# Altium schematic sheet ETH_Wifi.SCHDOC
size A4; SheetNumber: 0; SheetTotal: 0
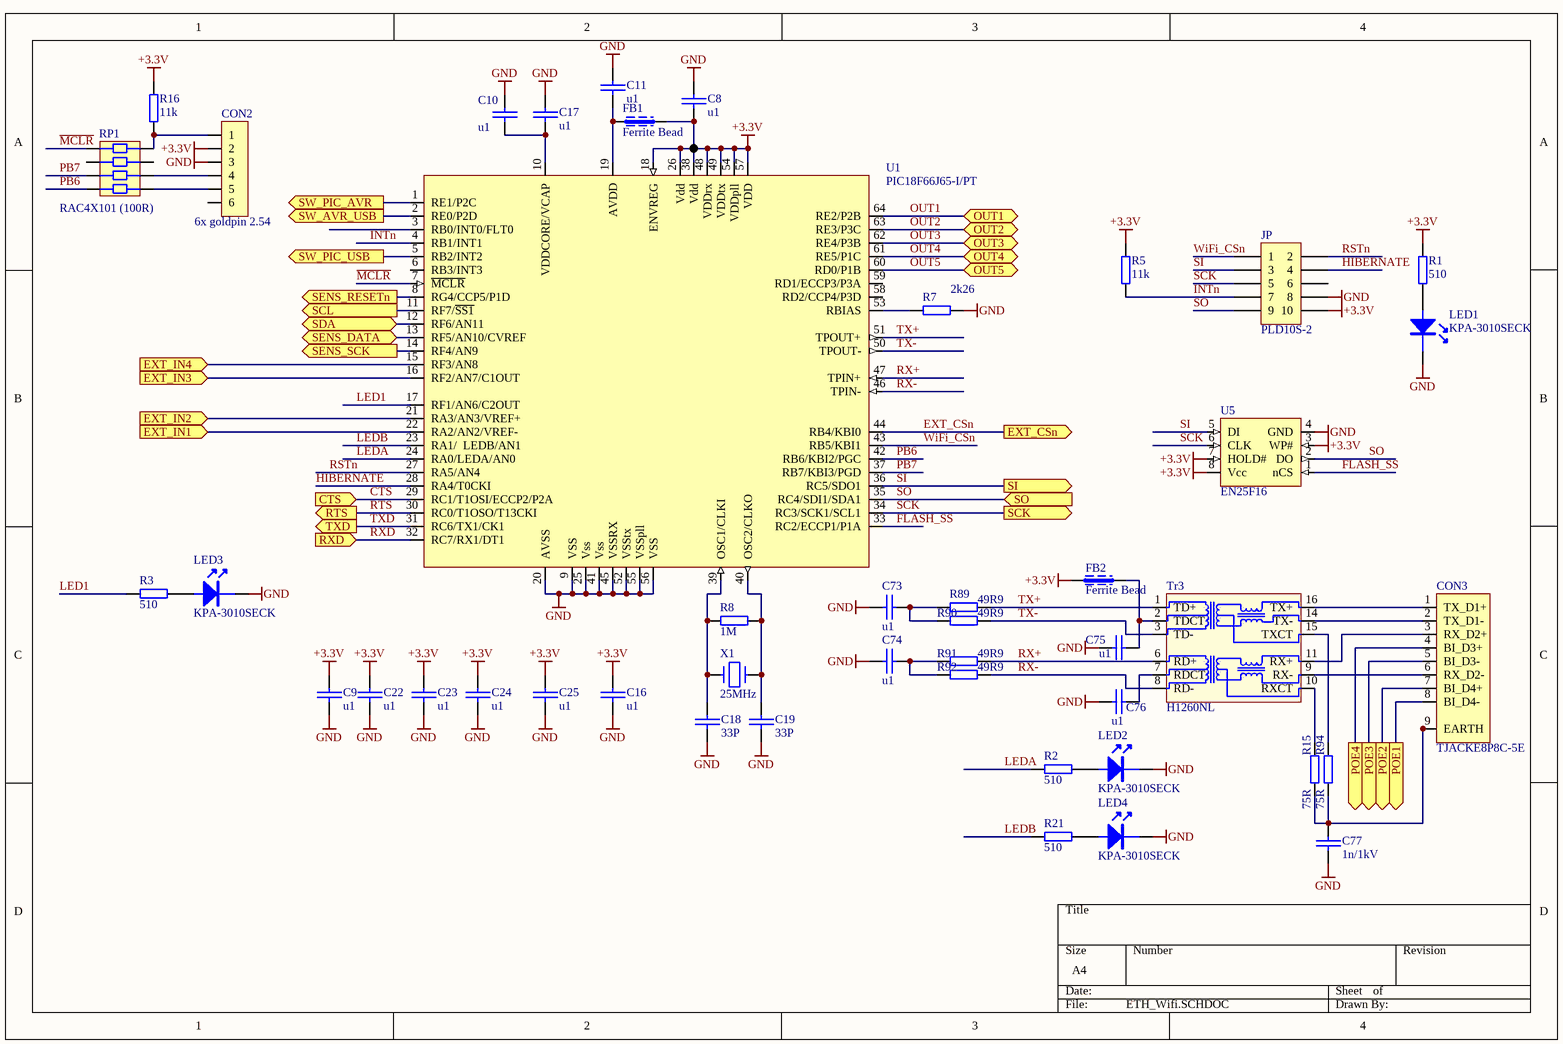
[diagram p0: ETH_Wifi.SCHDOC]

## Parts
C8  u1  [0603]
C9  u1  [0603]
C10  u1  [0603]
C11  u1  [0603]
C16  u1  [0603]
C17  u1  [0603]
C18  33P  [0603]
C19  33P  [0603]
C22  u1  [0603]
C23  u1  [0603]
C24  u1  [0603]
C25  u1  [0603]
C73  u1  [0603]
C74  u1  [0603]
C75  u1  [0603]
C76  u1  [0603]
C77  1n/1kV  [cap_ceram]
CON2  6x goldpin 2.54  [SIP6]
CON3  TJACKE8P8C-5E  [TJACKE8P8C-5E]
FB1  Ferrite Bead  [0603]
FB2  Ferrite Bead  [0603]
JP  PLD10S-2  [HEADER5X2]
LED1  KPA-3010SECK  [LED_KPA3010]
LED2  KPA-3010SECK  [LED_KPA3010]
LED3  KPA-3010SECK  [LED_KPA3010]
LED4  KPA-3010SECK  [LED_KPA3010]
R1  510  [0603]
R2  510  [0603]
R3  510  [0603]
R5  11k  [0603]
R7  2k26  [0603]
R8  1M  [0603]
R15  75R  [0603]
R16  11k  [0603]
R21  510  [0603]
R89  49R9  [0603]
R90  49R9  [0603]
R91  49R9  [0603]
R92  49R9  [0603]
R94  75R  [0603]
RP1  RAC4X101 (100R)  [CAY-16]
Tr3  H1260NL  [H1260NL]
U1  PIC18F66J65-I/PT  [TQFP64-MAX]
U5  EN25F16  [SO-8L]
X1  25MHz  [HC-49SM]

## Ports
CTS (in), EXT_CSn (out), EXT_IN1 (in), EXT_IN2 (in), EXT_IN3 (in), EXT_IN4 (in), OUT1 (bidir), OUT2 (bidir), OUT3 (bidir), OUT4 (bidir), OUT5 (bidir), POE1 (out), POE2 (out), POE3 (out), POE4 (out), RTS (out), RXD (in), SCK (out), SCL (out), SDA (bidir), SENS_DATA (bidir), SENS_RESETn (out), SENS_SCK (out), SI (out), SO (in), SW_AVR_USB (out), SW_PIC_AVR (out), SW_PIC_USB (out), TXD (out)

## Nets
+3.3V: C8.2 C9.2 C16.1 C22.1 C23.1 C24.1 C25.1 CON2.2 FB1.2 FB2.1 JP.10 R1.1 R5.2 R16.2 U1.18(ENVREG) U1.26(Vdd) U1.38(Vdd) U1.48(VDDrx) U1.49(VDDtx) U1.54(VDDpll) U1.57(VDD) U5.3(WP#) U5.7(HOLD#) U5.8(Vcc)
GND: C8.1 C9.1 C10.1 C11.1 C16.2 C17.1 C18.1 C19.1 C22.2 C23.2 C24.2 C25.2 C73.1 C74.1 C75.1 C76.1 C77.2 CON2.3 JP.8 LED1.K LED2.K LED3.K LED4.K R7.2 U1.9(VSS) U1.20(AVSS) U1.25(Vss) U1.41(Vss) U1.45(VSSRX) U1.52(VSStx) U1.55(VSSpll) U1.56(VSS) U5.4(GND)
CTS: U1.29(RC1/T1OSI/ECCP2/P2A) ; port CTS
EXT_CSn: U1.44(RB4/KBI0) ; port EXT_CSn
EXT_IN1: U1.22(RA2/AN2/VREF-) ; port EXT_IN1
EXT_IN2: U1.21(RA3/AN3/VREF+) ; port EXT_IN2
EXT_IN3: U1.16(RF2/AN7/C1OUT) ; port EXT_IN3
EXT_IN4: U1.15(RF3/AN8) ; port EXT_IN4
FLASH_SS: U1.33(RC2/ECCP1/P1A) U5.1(nCS)
HIBERNATE: JP.4 U1.28(RA4/T0CKI)
INTn: JP.7 R5.1 U1.4(RB1/INT1)
LED1: R3.2 U1.17(RF1/AN6/C2OUT)
LEDA: R2.2 U1.24(RA0/LEDA/AN0)
LEDB: R21.2 U1.23(RA1/__LEDB/AN1)
~{MCLR}: RP1.1 U1.7(~{MCLR})
OUT1: U1.64(RE2/P2B) ; port OUT1
OUT2: U1.63(RE3/P3C) ; port OUT2
OUT3: U1.62(RE4/P3B) ; port OUT3
OUT4: U1.61(RE5/P1C) ; port OUT4
OUT5: U1.60(RD0/P1B) ; port OUT5
PB6: RP1.4 U1.42(RB6/KBI2/PGC)
PB7: RP1.3 U1.37(RB7/KBI3/PGD)
POE1: CON3.8(BI_D4-) ; port POE1
POE2: CON3.7(BI_D4+) ; port POE2
POE3: CON3.5(BI_D3-) ; port POE3
POE4: CON3.4(BI_D3+) ; port POE4
RSTn: JP.2 U1.27(RA5/AN4)
RTS: U1.30(RC0/T1OSO/T13CKI) ; port RTS
RX+: R91.2 Tr3.6(RD+) U1.47(TPIN+)
RX-: R92.2 Tr3.8(RD-) U1.46(TPIN-)
RXD: U1.32(RC7/RX1/DT1) ; port RXD
SCK: JP.5 U1.34(RC3/SCK1/SCL1) U5.6(CLK) ; port SCK
SCL: U1.11(RF7/~{SS1}) ; port SCL
SDA: U1.12(RF6/AN11) ; port SDA
SENS_DATA: U1.13(RF5/AN10/CVREF) ; port SENS_DATA
SENS_RESETn: U1.8(RG4/CCP5/P1D) ; port SENS_RESETn
SENS_SCK: U1.14(RF4/AN9) ; port SENS_SCK
SI: JP.3 U1.36(RC5/SDO1) U5.5(DI) ; port SI
SO: JP.9 U1.35(RC4/SDI1/SDA1) U5.2(DO) ; port SO
SW_AVR_USB: U1.2(RE0/P2D) ; port SW_AVR_USB
SW_PIC_AVR: U1.1(RE1/P2C) ; port SW_PIC_AVR
SW_PIC_USB: U1.5(RB2/INT2) ; port SW_PIC_USB
TX+: R89.2 Tr3.1(TD+) U1.51(TPOUT+)
TX-: R90.2 Tr3.3(TD-) U1.50(TPOUT-)
TXD: U1.31(RC6/TX1/CK1) ; port TXD
WiFi_CSn: JP.1 U1.43(RB5/KBI1)
NetC10_2: C10.2 C17.2 U1.10(VDDCORE/VCAP)
NetC11_2: C11.2 FB1.1 U1.19(AVDD)
NetC18_2: C18.2 R8.1 U1.39(OSC1/CLKI) X1.1
NetC19_2: C19.2 R8.2 U1.40(OSC2/CLKO) X1.2
NetC73_2: C73.2 R89.1 R90.1
NetC74_2: C74.2 R91.1 R92.1
NetC75_2: C75.2 FB2.2 Tr3.2(TDCT)
NetC76_2: C76.2 Tr3.7(RDCT)
NetC77_1: C77.1 CON3.9(EARTH) CON3.9b CON3.9c CON3.9d R15.1 R94.1
NetCON2_1: CON2.1 R16.1 RP1.8
NetCON2_4: CON2.4 RP1.6
NetCON2_5: CON2.5 RP1.5
NetCON3_1: CON3.1(TX_D1+) Tr3.16(TX+)
NetCON3_2: CON3.2(TX_D1-) Tr3.14(TX-)
NetCON3_3: CON3.3(RX_D2+) Tr3.11(RX+)
NetCON3_6: CON3.6(RX_D2-) Tr3.9(RX-)
NetLED1_A: LED1.A R1.2
NetLED2_A: LED2.A R2.1
NetLED3_A: LED3.A R3.1
NetLED4_A: LED4.A R21.1
NetR7_1: R7.1 U1.53(RBIAS)
NetR15_2: R15.2 Tr3.10(RXCT)
NetR94_2: R94.2 Tr3.15(TXCT)

Not connected (* = marked no-connect by the designer): CON2 6; JP 6; RP1 2 7; U1 3(RB0/INT0/FLT0) 6(RB3/INT3) 58(RD2/CCP4/P3D) 59(RD1/ECCP3/P3A)

## Library data of the parts
C8-C11 C16-C19 C22-C25 C73-C76 = CAP_SMD: Capacitor SMD
C77 = CAP: Capacitor
CON2 = CON6
CON3 = CON_RJ45_shielded: RJ 45 connector (Maritex)
FB1 FB2 = L_FERRITE_BEAD
JP = CON_HEADER 5X2: Goldpin 2.54mm
LED1-LED4 = LED_SMD_90deg: LED (TME)
R1-R3 R5 R7 R8 R15 R16 R21 R89-R92 R94 = RES_SMD: SMD Resistor
RP1 = CAY-16: Resistor network 1206 (4x0402) Maritex RAC4Xxxx
Tr3 = TR_H1260NL: ethernet trafo (TME)
U1 = PIC18F66J60
U5 = MEM_EN25F16: FLASH (maritex)
X1 = CRYSTAL: Crystal oscillator